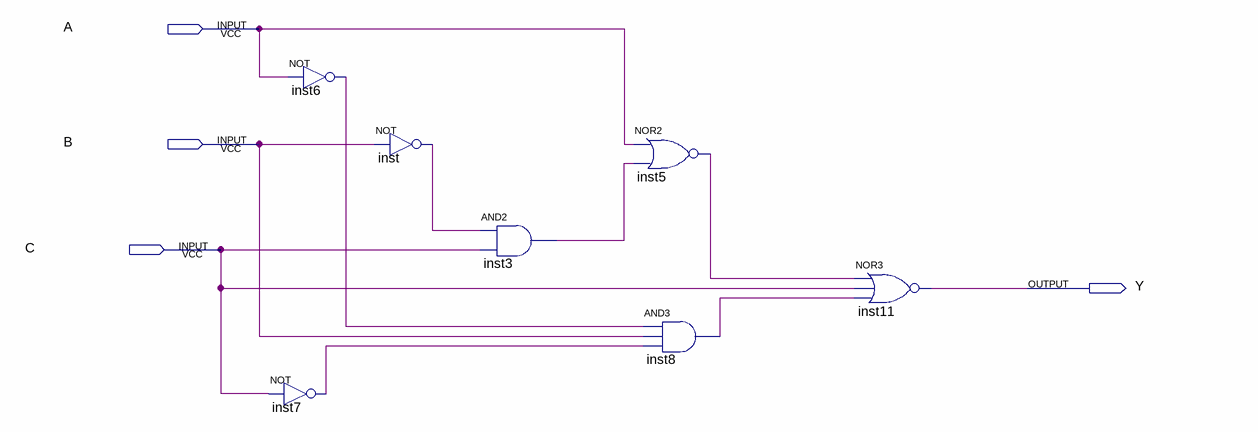
[diagram p0: schematic sheet]
// Quartus schematic Demo01.bdf as structural Verilog: 7 symbols, 4 pins
module Demo01 (
  input  A,
  input  B,
  input  C,
  output Y
);

  wire inst3_out, inst5_out, inst6_out, inst7_out, inst8_out, inst_out;

  not inst6 (inst6_out, A);
  not inst7 (inst7_out, C);
  not inst (inst_out, B);
  and inst3 (inst3_out, inst_out, C);
  nor inst5 (inst5_out, A, inst3_out);
  and inst8 (inst8_out, inst6_out, B, inst7_out);
  nor inst11 (Y, inst5_out, C, inst8_out);
endmodule
